# Altium schematic sheet HighCurrentFetGND.SchDoc
size A4
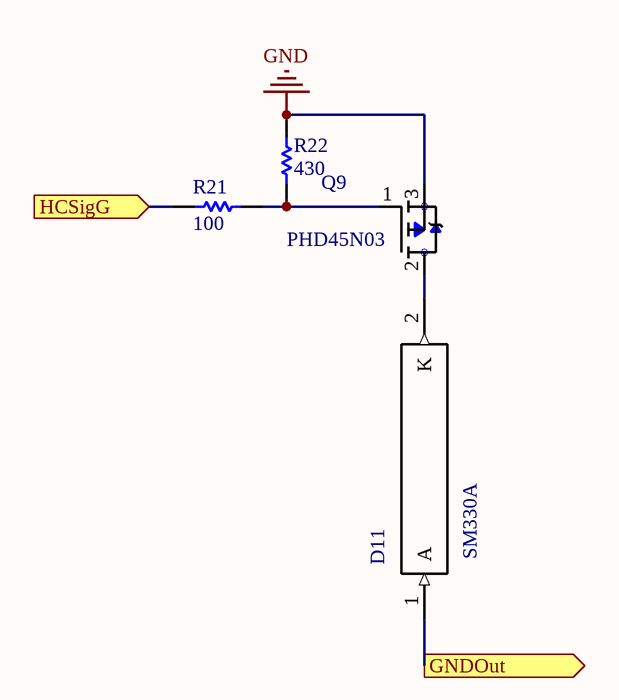
[diagram p0: HighCurrentFetGND.SchDoc]

## Parts
D11  SM330A  [*DIOM5227X270N_S1M(Primary)]
Q9  PHD45N03  [*DPAK228P998X235-3N]
R21  value 100  [6-0805_L]  (hidden comment: R100)
R22  value 430  [6-0805_L]  (hidden comment: R430)

## Ports
GNDOut (out), HCSigG (in)

## Nets
GND: Q9.3(S) R22.1
GNDOut: D11.1(A) ; port GNDOut
HCSigG: R21.1 ; port HCSigG
NetD11_2: D11.2(K) Q9.2(D)
NetQ9_1: Q9.1(G) R21.2 R22.2

## Notes on the sheet
- Title
- Size:
- Date:
- A4
- Number:
- Time:
- Revision:
- Sheet
- of
- File:

## Library data of the parts
D11 = STPS2L60A: SCHOTTKY RECTIFIER 2A; Voltage Vrrm: 60V; Diode Case Style: DO-214AC; Case Style: DO-214AC; pin to pad: 1>A 2>A; MF: STMicroelectronics; Price: None; Availability: Unavailable; SnapEDA_Link: https://www.snapeda.com/parts/STPS2L60A/STMicroelectronics/view-part/?ref=snap; Package: DO-214 STMicroelectronics; MP: STPS2L60A; Value: *
Q9 = IPD50P04P4L-11: P-Channel 40 V 10.6 mOhm OptiMOSآ®-P2 Power-Transistor -PG-TO-252-3; MF: Infineon Technologies; MP: IPD50P04P4L-11; Package: TO-252-3 Infineon; Price: None; Availability: Unavailable; SnapEDA_Link: https://www.snapeda.com/parts/IPD50P04P4L-11/Infineon%20Technologies/view-part/?ref=snap; Value: *
R21 R22 = Res1: Resistor; Published: 8-Jun-2000; LatestRevisionDate: 17-Jul-2002; LatestRevisionNote: Re-released for DXP Platform.; PackageReference: AXIAL-0.3; Publisher: Altium Limited; PackageDescription: Axial Device, Thru-Hole; 2 Leads; 0.3 in Pin Spacing